# Altium schematic sheet HardwareArchitecture.SchDoc: Iris
size A3; Organization: Toradex AG; Address1: Altsagenstrasse 5; Address2: Horw; Address3: 6048; Address4: Switzerland; DocumentNumber: 2; Revision: V2.0; SheetNumber: 2; SheetTotal: 16; PageSetup: Record=PageOptions|CenterHorizontal=True|CenterVertical=True|PrintScale=0.73|XCorrection=1.00|YCorrection=1.00|PrintKind=0|BorderSize=5000000|LeftOffset=0|BottomOffset=0|Orientation=2|PaperLength=1000|PaperWidth=1000|Scale=100|PaperSource=7|PrintQuality=600|MediaType=1|DitherType=10|PaperKind=A4|PrintScaleMode=1
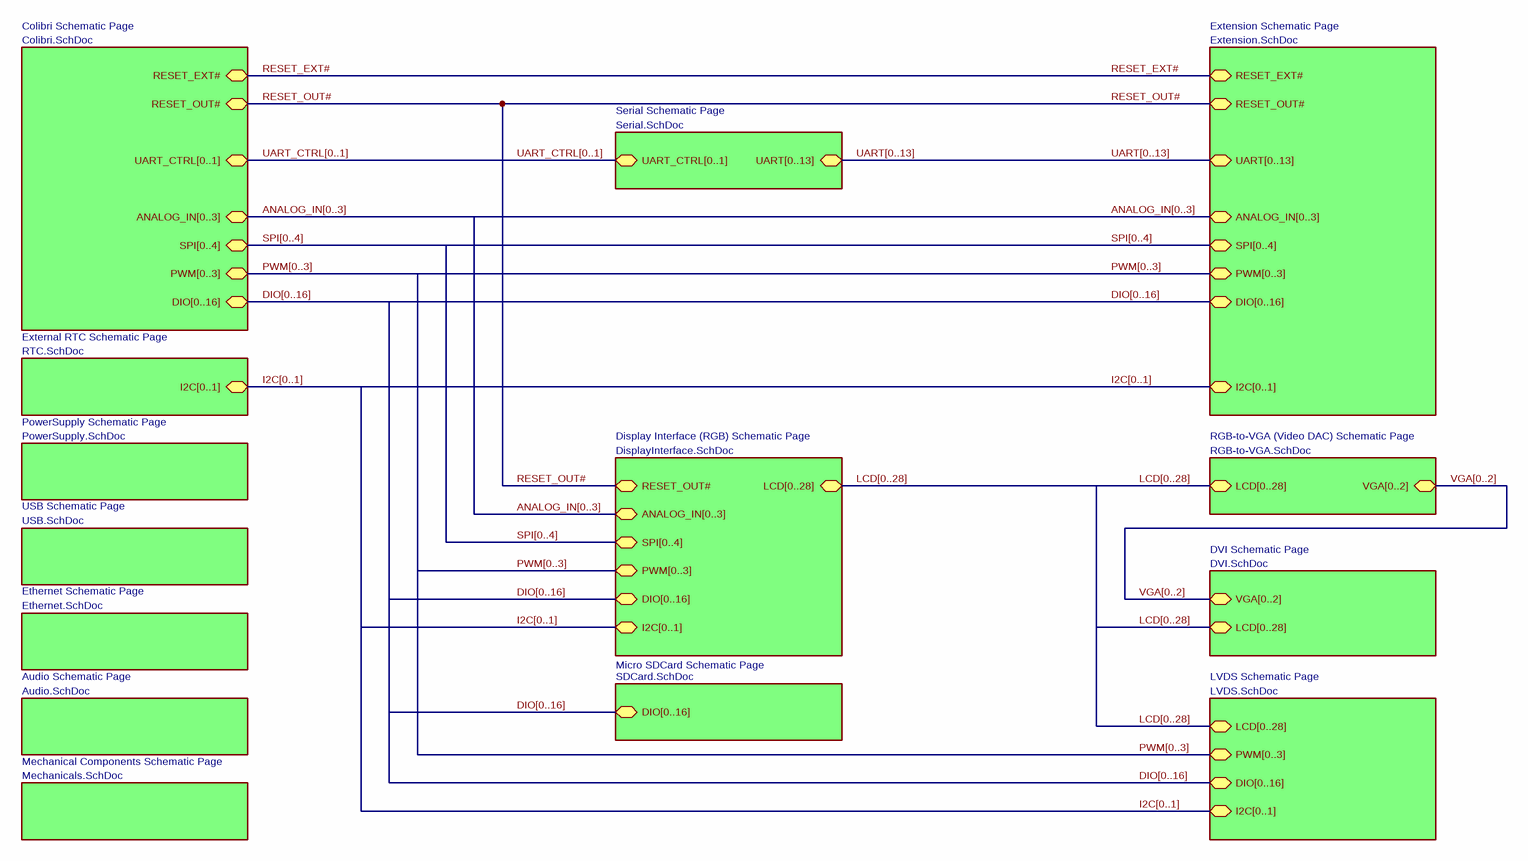
[diagram p0: HardwareArchitecture.SchDoc]

## Sub-sheets
Audio Schematic Page = Audio.SchDoc: no entries
Colibri Schematic Page = Colibri.SchDoc: ANALOG_IN[0..3] (bidir), DIO[0..16] (bidir), SPI[0..4] (bidir), UART_CTRL[0..1] (bidir), RESET_OUT# (bidir), PWM[0..3] (bidir), RESET_EXT# (bidir)
Display Interface (RGB) Schematic Page = DisplayInterface.SchDoc: I2C[0..1] (bidir), LCD[0..28] (bidir), SPI[0..4] (bidir), PWM[0..3] (bidir), ANALOG_IN[0..3] (bidir), DIO[0..16] (bidir), RESET_OUT# (bidir)
DVI Schematic Page = DVI.SchDoc: VGA[0..2] (bidir), LCD[0..28] (bidir)
Ethernet Schematic Page = Ethernet.SchDoc: no entries
Extension Schematic Page = Extension.SchDoc: DIO[0..16] (bidir), I2C[0..1] (bidir), PWM[0..3] (bidir), ANALOG_IN[0..3] (bidir), SPI[0..4] (bidir), UART[0..13] (bidir), RESET_EXT# (bidir), RESET_OUT# (bidir)
External RTC Schematic Page = RTC.SchDoc: I2C[0..1] (bidir)
LVDS Schematic Page = LVDS.SchDoc: LCD[0..28] (bidir), DIO[0..16] (bidir), PWM[0..3] (bidir), I2C[0..1] (bidir)
Mechanical Components Schematic Page = Mechanicals.SchDoc: no entries
Micro SDCard Schematic Page = SDCard.SchDoc: DIO[0..16] (bidir)
PowerSupply Schematic Page = PowerSupply.SchDoc: no entries
RGB-to-VGA (Video DAC) Schematic Page = RGB-to-VGA.SchDoc: LCD[0..28] (bidir), VGA[0..2] (bidir)
Serial Schematic Page = Serial.SchDoc: UART[0..13] (bidir), UART_CTRL[0..1] (bidir)
USB Schematic Page = USB.SchDoc: no entries

## Nets
RESET_EXT#: sheet Colibri Schematic Page/RESET_EXT#, sheet Extension Schematic Page/RESET_EXT#
RESET_OUT#: sheet Colibri Schematic Page/RESET_OUT#, sheet Display Interface (RGB) Schematic Page/RESET_OUT#, sheet Extension Schematic Page/RESET_OUT#

## Buses and harness runs
bus ANALOG_IN[0..3] = sheet Colibri Schematic Page/ANALOG_IN[0..3] = sheet Display Interface (RGB) Schematic Page/ANALOG_IN[0..3] = sheet Extension Schematic Page/ANALOG_IN[0..3]
bus DIO[0..16] = sheet Colibri Schematic Page/DIO[0..16] = sheet Display Interface (RGB) Schematic Page/DIO[0..16] = sheet Extension Schematic Page/DIO[0..16] = sheet LVDS Schematic Page/DIO[0..16] = sheet Micro SDCard Schematic Page/DIO[0..16]
bus I2C[0..1] = sheet Display Interface (RGB) Schematic Page/I2C[0..1] = sheet Extension Schematic Page/I2C[0..1] = sheet External RTC Schematic Page/I2C[0..1] = sheet LVDS Schematic Page/I2C[0..1]
bus LCD[0..28] = sheet Display Interface (RGB) Schematic Page/LCD[0..28] = sheet DVI Schematic Page/LCD[0..28] = sheet LVDS Schematic Page/LCD[0..28] = sheet RGB-to-VGA (Video DAC) Schematic Page/LCD[0..28]
bus PWM[0..3] = sheet Colibri Schematic Page/PWM[0..3] = sheet Display Interface (RGB) Schematic Page/PWM[0..3] = sheet Extension Schematic Page/PWM[0..3] = sheet LVDS Schematic Page/PWM[0..3]
bus SPI[0..4] = sheet Colibri Schematic Page/SPI[0..4] = sheet Display Interface (RGB) Schematic Page/SPI[0..4] = sheet Extension Schematic Page/SPI[0..4]
bus UART[0..13] = sheet Extension Schematic Page/UART[0..13] = sheet Serial Schematic Page/UART[0..13]
bus UART_CTRL[0..1] = sheet Colibri Schematic Page/UART_CTRL[0..1] = sheet Serial Schematic Page/UART_CTRL[0..1]
bus VGA[0..2] = sheet DVI Schematic Page/VGA[0..2] = sheet RGB-to-VGA (Video DAC) Schematic Page/VGA[0..2]

## Notes on the sheet
- Title
- Size:
- Date:
- A3
- Number:
- Time:
- Revision:
- Sheet
- of
- File: